# EAGLE design iridia-tam-right-board (EAGLE 6.4)
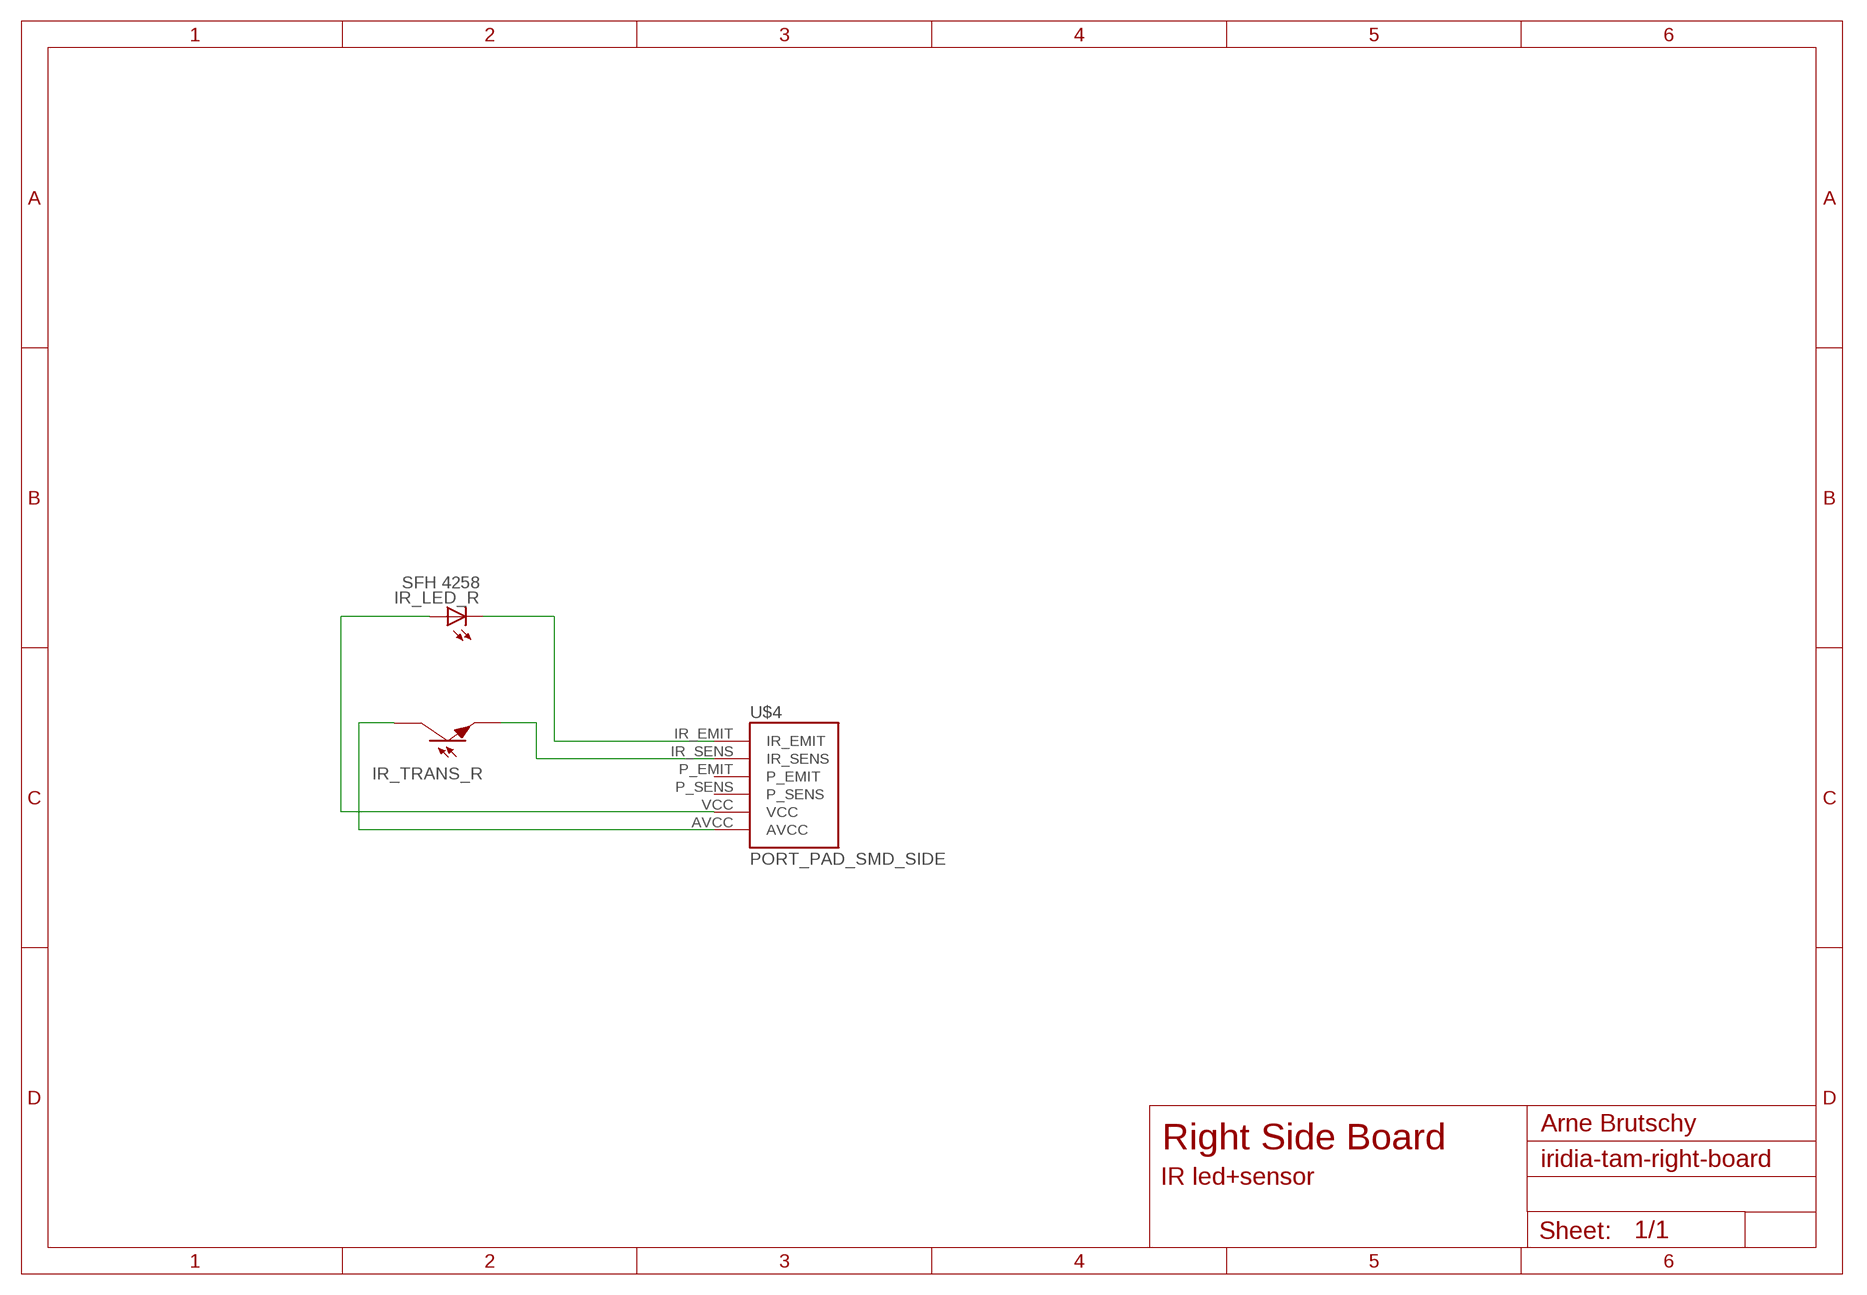
[diagram p0: schematic, sheet 1]

## Parts
IR_LED_R  SFH 4258  LEDP-LCC-4  [P-LCC-4-1C-3A]
IR_TRANS_R  SFH 320 FA  IR_TRANSP-LCC-2  [P-LCC-2-TRANS]
U$4  PORT_PAD_SMD_SIDE  [PORT_PAD_SMD_SIDE]

## Nets
IR_EMIT_R: IR_LED_R.C@1(C) U$4.IR_EMIT
IR_SENSE_R: IR_TRANS_R.E U$4.IR_SENS
N$1: IR_TRANS_R.COL U$4.AVCC
VCC [power]: IR_LED_R.A@2(A) IR_LED_R.A@3(A) IR_LED_R.A@4(A) U$4.VCC
Unconnected: U$4.P_EMIT U$4.P_SENS

## Notes on the sheet
- Arne Brutschy
- Right Side Board
- IR led+sensor

## Library data of the parts
IR_LED_R = iridia:LED: LED OSRAM: - CHIPLED LG R971, LG N971, LY N971, LG Q971, LY Q971, LO R971, LY R971 LH N974, LH R974 LS Q976, LO Q976, LY Q976 LO Q996 - Hyper CHIPLED LW Q18S LB Q993, LB Q99A, LB R99A - SideLED LS A670, LO A670, LY A670, LG A670, LP A670 LB A673, LV A673, LT A673, LW A673 LH A674 LY A675 LS A676, LA A676, LO A676, LY A676, LW A676 LS A679, LY A679, LG A679 - Hyper Micro SIDELED® LS Y876, LA Y876, LO Y876, LY Y876 LT Y87S - SmartLED LW L88C, LW L88S LB L89C, LB L89S, LG L890 LS L89K, LO L89K, LY L89K LS L896, LA L896, LO L896, LY L896 - TOPLED LS T670, LO T670, LY T670, LG T670, LP T670 LSG T670, LSP T670, LSY T670, LOP T670, LYG T670 LG T671, LOG T671, LSG T671 LB T673, LV T673, LT T673, LW T673 LH T674 LS T676, LA T676, LO T676, LY T676, LB T676, LH T676, LSB T676, LW T676 LB T67C, LV T67C, LT T67C, LS T67K, LO T67K, LY T67K, LW E67C LS E67B, LA E67B, LO E67B, LY E67B, LB E67C, LV E67C, LT E67C LW T67C LS T679, LY T679, LG T679 LS T770, LO T770, LY T770, LG T770, LP T770 LB T773, LV T773, LT T773, LW T773 LH T774 LS E675, LA E675, LY E675, LS T675 LS T776, LA T776, LO T776, LY T776, LB T776 LHGB T686 LT T68C, LB T68C - Hyper Mini TOPLED® LB M676 - Mini TOPLED Santana® LG M470 LS M47K, LO M47K, LY M47K Source: http://www.osram.convergy.de LUXEON: - LUMILED® LXK2-PW12-R00, LXK2-PW12-S00, LXK2-PW14-U00, LXK2-PW14-V00 LXK2-PM12-R00, LXK2-PM12-S00, LXK2-PM14-U00 LXK2-PE12-Q00, LXK2-PE12-R00, LXK2-PE12-S00, LXK2-PE14-T00, LXK2-PE14-U00 LXK2-PB12-K00, LXK2-PB12-L00, LXK2-PB12-M00, LXK2-PB14-N00, LXK2-PB14-P00, LXK2-PB14-Q00 LXK2-PR12-L00, LXK2-PR12-M00, LXK2-PR14-Q00, LXK2-PR14-R00 LXK2-PD12-Q00, LXK2-PD12-R00, LXK2-PD12-S00 LXK2-PH12-R00, LXK2-PH12-S00 LXK2-PL12-P00, LXK2-PL12-Q00, LXK2-PL12-R00 Source: www.luxeon.com KINGBRIGHT: KA-3528ASYC Source: www.kingbright.com
IR_TRANS_R = iridia:IR_TRANS: IR TRANSITOR Package P-LCC-2 Osram SFH 320, SFH 320 FA
U$4 = iridia:PORT_PAD_SMD_SIDE: Connector pad for soldering side boards on side board of IRIDIA TAM

## Net classes
0 default: width 0.254 mm, drill 0.305 mm, clearance 0.152 mm
1 power: width 0.381 mm, clearance 0.254 mm
2 gnd: width 0.305 mm, drill 0.152 mm, clearance 0.152 mm
3 usbvcc: width 0.508 mm, drill 0.508 mm, clearance 0.152 mm
4 aref: width 0.406 mm

## Board
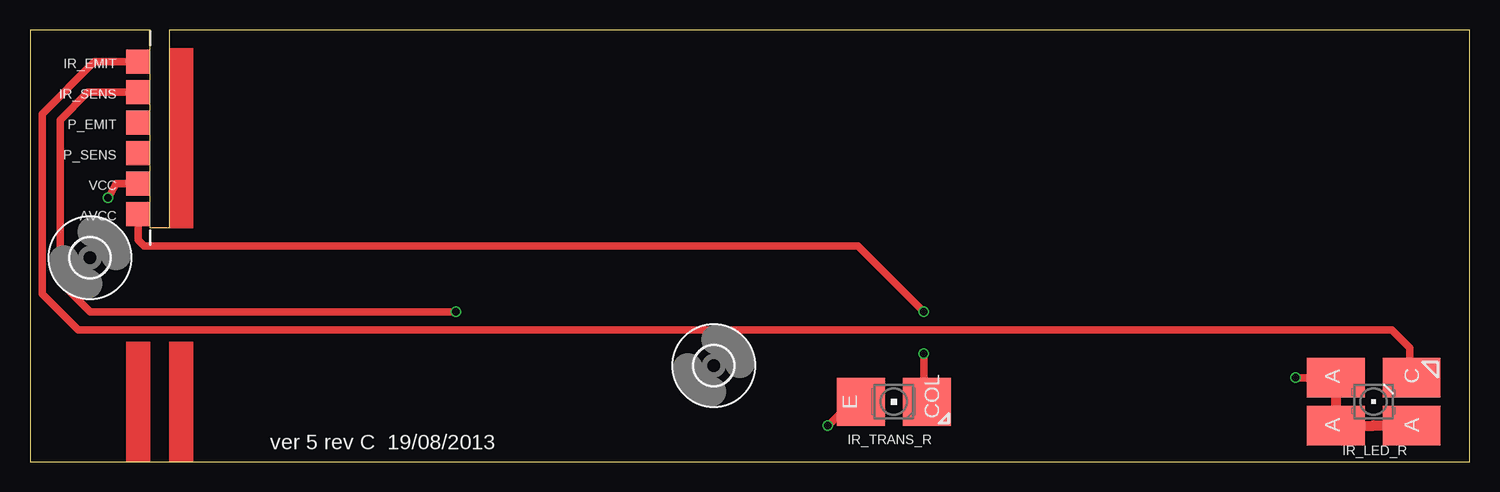
[diagram p1: board, top side]
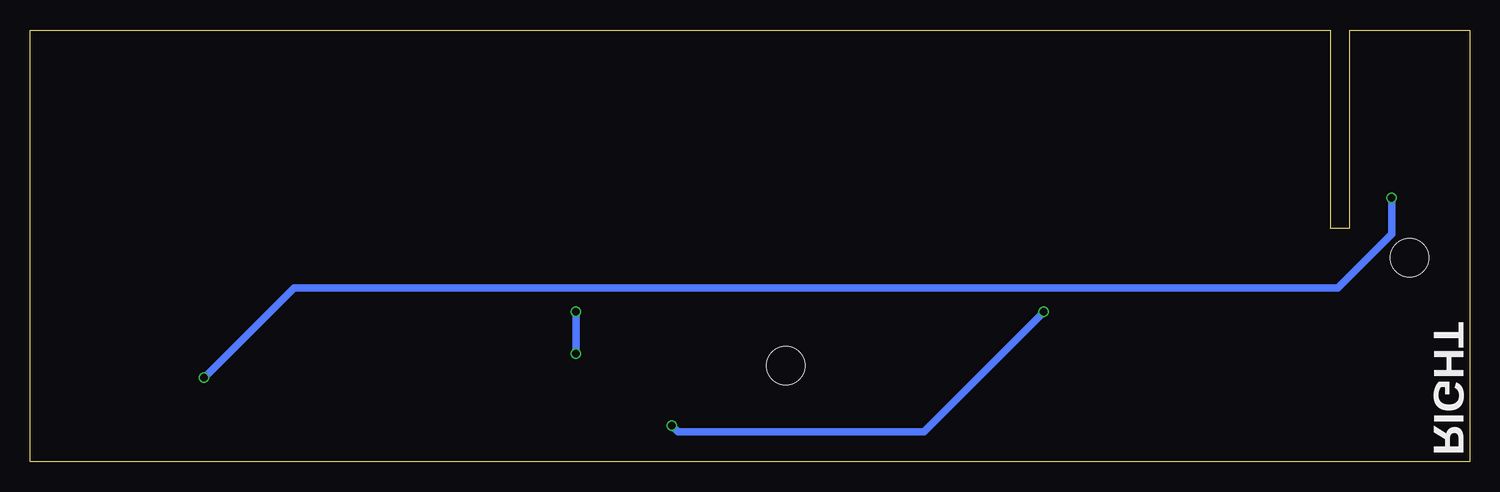
[diagram p2: board, bottom side, seen from below]

Size 120 x 36 mm. Coordinates in mm from the lower left corner, seen from the top.
Outline: 0,0 120,0 120,36 11.6,36 11.6,19.5 10,19.5 10,36 0,36 0,0
Copper layers (1*16): Top 0.035mm / dielectric 1.5mm / Bottom 0.035mm
Design rules "myropcb": minimum track width 4mil, minimum drill 6mil, track to track 4mil, track to pad 4mil, pad to pad 4mil, via to via 4mil, smd to smd 0mil, copper to edge 10mil, drill to drill 10mil, minimum pad ring 10mil, minimum via ring 6mil, stop-mask expansion 2mil, vias tented up to drill 100mil, thermal gap 10mil

### Footprints (pad centres in the part's own frame; a part is rotated, then mirrored left to right if it is on the bottom)
P-LCC-4-1C-3A = smd 3.3 x 4.8: A@2 -2,-3.15; A@3 -2,3.15; A@4 2,3.15; C@1 2,-3.15
P-LCC-2-TRANS = smd 4 x 4: COL 0,-2.75; E 0,2.75
3,2 = hole 3.2: 0,0
PORT_PAD_SMD_SIDE = smd 2 x 2: AVCC 0,6.35; IR_EMIT 0,-6.35; IR_SENS 0,-3.81; P_EMIT 0,-1.27; P_SENS 0,1.27; VCC 0,3.81

### Placement (x,y rotation side)
IR_LED_R  112,5 90 top
IR_TRANS_R  72,5 90 top
U$1  [3,2]  5,17 0 top
U$3  [3,2]  57,8 0 top
U$4  9,27 180 top

### Tracks (layer width: path | path; a pad name or v marks a point on that pad's centre or on a via)
IR_EMIT_R
  Top 0.406: 115,7.15 IR_LED_R.C@1
  Top 0.61: U$4.IR_EMIT 5.35,33.35 1,29 1,14 4,11 113.5,11 115,9.5 115,7.5 115,7.15
  Top 0.813: 114.5,8 115,7.5
IR_SENSE_R  (via drill 0.6)
  Top 0.406: 68.5,5 IR_TRANS_R.E
  Top 0.61: U$4.IR_SENS 4.81,30.81 2.5,28.5 2.5,15 5,12.5 v35.5,12.5 | v66.5,3 68.5,5
  Bottom 0.61: v35.5,12.5 45.5,2.5 66,2.5 v66.5,3
N$1  (via drill 0.6)
  Top 0.61: U$4.AVCC 9,18.5 9.5,18 69,18 v74.5,12.5 | v74.5,9 74.5,5.25 IR_TRANS_R.COL
  Bottom 0.61: v74.5,12.5 v74.5,9
VCC  (via drill 0.6)
  Top 0.61: U$4.VCC 7.19,23.19 v6.5,22 | v105.5,7 IR_LED_R.A@4
  Top 0.813: 112.01,3 IR_LED_R.A@3 IR_LED_R.A@4 108.8,7.05 | 115.32,3.05 115.06,3.05 115.06,3 IR_LED_R.A@2 112.01,3 | 112.01,3 112.01,3.05
  Bottom 0.61: v6.5,22 6.5,19 11,14.5 98,14.5 v105.5,7
(copper drawn outside any net)
  shapes: Top area x3

### Text on the board
tPlace: ver 5 rev C 19/08/2013
bNames: RIGHT